# Altium schematic sheet Control.SchDoc: Primary Side Hardware - Control
size A4; Author: Primary Team; Revision: A; SheetNumber: 2; SheetTotal: 3
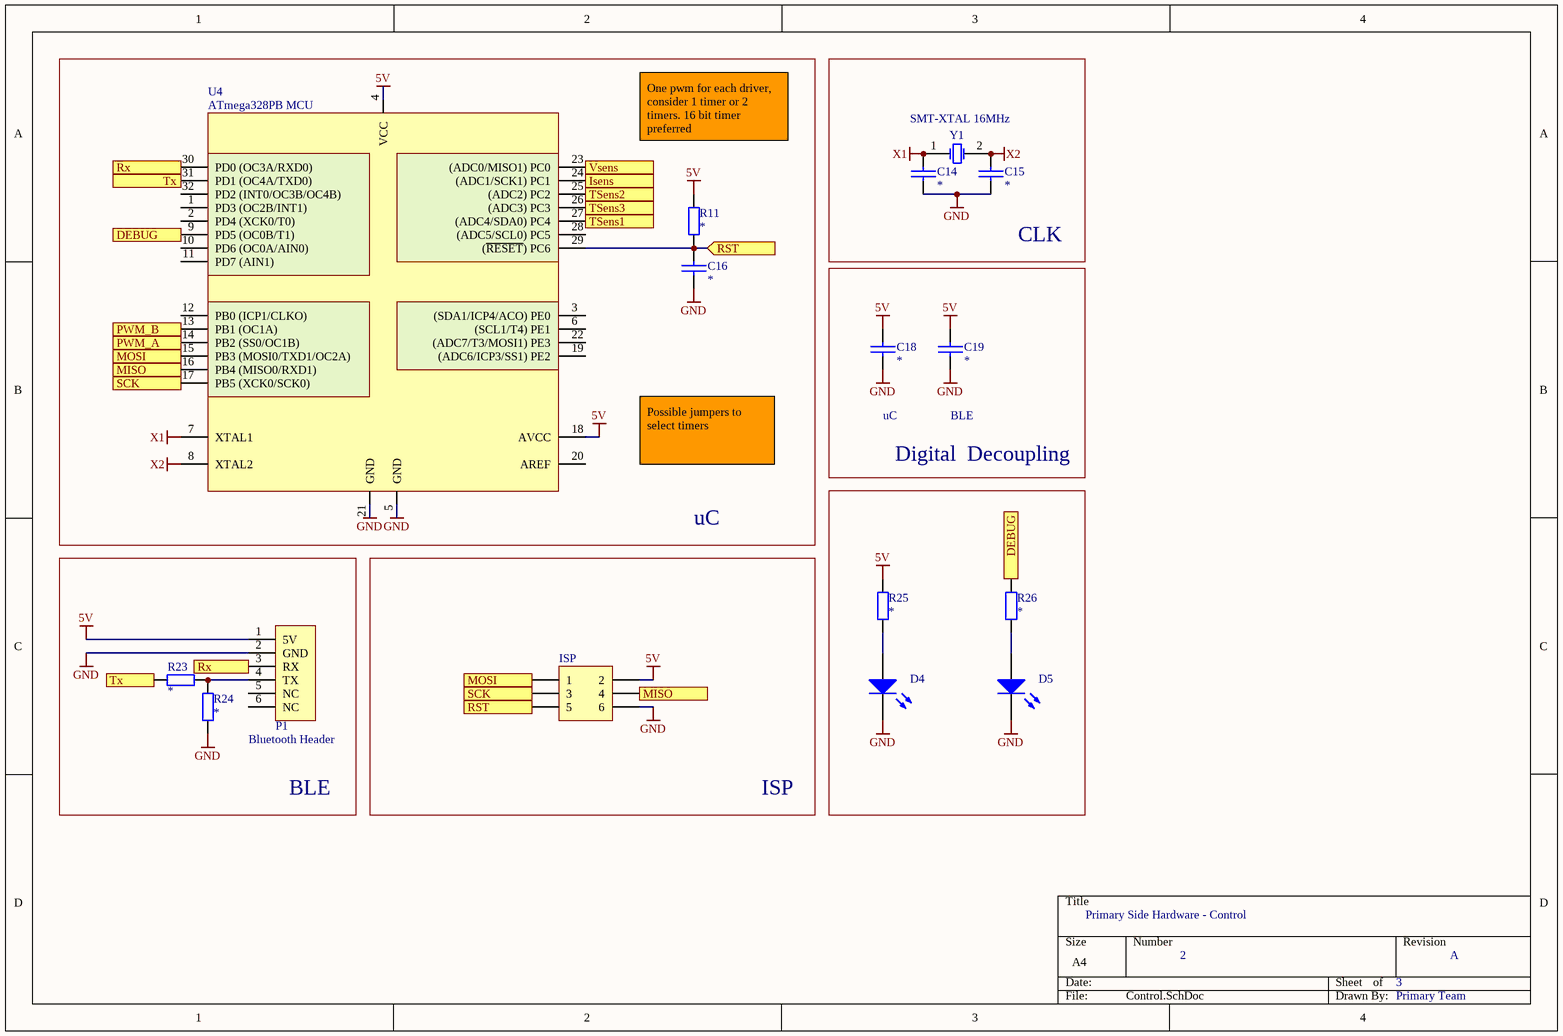
[diagram p0: Control.SchDoc]

## Parts
C14  *  [C0805]
C15  *  [C0805]
C16  *  [C0805]
C18  *  [C0805]
C19  *  [C0805]
D4  LTST-C170KGKT  [0805 LED]  (value not drawn)
D5  LTST-C170KGKT  [0805 LED]  (value not drawn)
ISP  P2  [HDR2X3]  (value not drawn)
P1  BLE Module Header  [HM10_HDR1X6]  (value not drawn)
R11  *  [R0805]
R23  *  [R0805]
R24  *  [R0805]
R25  *  [R0805]
R26  *  [R0805]
U4  ATmega328PB MCU  [32 - TQFP]
Y1  SMT-XTAL 16MHz  [HC49-US]

## Blocks framed on the sheet
uC: C16 R11 U4
CLK: C14 C15 Y1
BLE: P1 R23 R24
ISP: ISP

## Ports
DEBUG (in), DEBUG (out), Isens (in), MISO (in), MISO (out), MOSI (in), MOSI (out), PWM_A (out), PWM_B (out), RST (in), RST (out), Rx (in), Rx (out), SCK (in), SCK (out), TSens1 (in), TSens2 (in), TSens3 (in), Tx (in), Tx (out), Vsens (in)

## Nets
5V: C18.1 C19.1 ISP.2 P1.1(5V) R11.2 R25.2 U4.4(VCC) U4.18(AVCC)
GND: C14.2 C15.2 C16.2 C18.2 C19.2 D4.2(K) D5.2(K) ISP.6 P1.2(GND) R24.1 U4.5(GND) U4.21(GND)
X1: C14.1 U4.7(XTAL1) Y1.1(OSC1)
X2: C15.1 U4.8(XTAL2) Y1.2(OSC2)
DEBUG: R26.2 U4.9(PD5_(OC0B/T1)) ; port DEBUG
Isens: U4.24((ADC1/SCK1)_PC1) ; port Isens
MISO: ISP.4 U4.16(PB4_(MISO0/RXD1)) ; port MISO
MOSI: ISP.1 U4.15(PB3_(MOSI0/TXD1/OC2A)) ; port MOSI
PWM_A: U4.14(PB2_(SS0/OC1B)) ; port PWM_A
PWM_B: U4.13(PB1_(OC1A)) ; port PWM_B
RST: C16.1 ISP.5 R11.1 U4.29((~{RESET})_PC6) ; port RST
Rx: P1.3(RX) U4.30(PD0_(OC3A/RXD0)) ; port Rx
SCK: ISP.3 U4.17(PB5_(XCK0/SCK0)) ; port SCK
TSens1: U4.27((ADC4/SDA0)_PC4) ; port TSens1
TSens2: U4.25((ADC2)_PC2) ; port TSens2
TSens3: U4.26((ADC3)_PC3) ; port TSens3
Tx: R23.1 U4.31(PD1_(OC4A/TXD0)) ; port Tx
Vsens: U4.23((ADC0/MISO1)_PC0) ; port Vsens
NetD4_1: D4.1(A) R25.1
NetD5_1: D5.1(A) R26.1
NetP1_4: P1.4(TX) R23.2 R24.2

Not connected (* = marked no-connect by the designer): P1 5(NC) 6(NC); U4 1(PD3_(OC2B/INT1)) 2(PD4_(XCK0/T0)) 3((SDA1/ICP4/ACO)_PE0) 6((SCL1/T4)_PE1) 10(PD6_(OC0A/AIN0)) 11(PD7_(AIN1)) 12(PB0_(ICP1/CLKO)) 19((ADC6/ICP3/SS1)_PE2) 20(AREF) 22((ADC7/T3/MOSI1)_PE3) 28((ADC5/SCL0)_PC5) 32(PD2_(INT0/OC3B/OC4B))

## Notes on the sheet
- One pwm for each driver, consider 1 timer or 2 timers. 16 bit timer preferred
- uC
- BLE
- Possible jumpers to select timers
- Digital  Decoupling
- Bluetooth Header
- Primary Team

## Library data of the parts
C14-C16 C18 C19 = CerCap_SMT: SMT ceramic capacitor selectable size; Value: *
D4 D5 = LED_SMT_0805: SMT LED 0805 size; Manufacturer: Lite-On Inc.; Color: Green; Lens Color: Colorless; Lens Transparency: Clear; Millicandela Rating: 35mcd; Lens Style/Size: Rectangle with Flat Top, 1.40mm x 1.25mm; Voltage - Forward (Vf) (Typ): 2V; Current - Test: 20mA; Viewing Angle: 130°; Wavelength - Dominant: 571nm; Wavelength - Peak: 574nm; Supplier 1: Digi-Key; Manufacturer Part Number: LTST-C170KGKT; RoHS: RoHS Compliant; Category: Optoelectronics; Stock 1: 503069; Pricing 1: 1=0.62, 10=0.459, 25=0.338, 100=0.2415, 250=0.16416, 500=0.14486, 1000=0.11347 (NZD); Packaging: Cut Tape (CT); Part Status: Active; Mounting Type: Surface Mount; Features: -; Package / Case: 0805 (2012 Metric); Size / Dimension: 2.00mm L x 1.25mm W; Height (Max): 1.10mm; ComponentLink1URL: http://optoelectronics.liteon.com/upload/download/DS22-2000-073/LTST-C170KGKT.pdf; ComponentLink1Description: http://optoelectronics.liteon.com/upload/download/DS22-2000-073/LTST-C170KGKT.pdf; Supplier Part Number 1: 160-1414-1-ND
ISP = Header 3X2: Header, 3-Pin, Dual row; LatestRevisionDate: 17-Jul-2002; LatestRevisionNote: Re-released for DXP Platform.; Publisher: Altium Limited
P1 = BLEModule_TH: 2.54mm pitch 6-pin header for BLE module; LatestRevisionDate: 17-Jul-2002; LatestRevisionNote: Re-released for DXP Platform.; Publisher: Altium Limited
R11 R23-R26 = Res_SMT: 0805 or 1206 resistor; Published: 8-Jun-2000; LatestRevisionDate: 17-Jul-2002; LatestRevisionNote: Re-released for DXP Platform.; PackageReference: AXIAL-0.4; Publisher: Altium Limited; Value: *; ComponentLink1Description: https://nz.mouser.com/datasheet/2/315/AOA0000C304-1149620.pdf
U4 = ATmega328PB_SMT_TQFP32: IC MCU 8BIT 32KB FLASH 32TQFP; Manufacturer: Atmel; Manufacturer Part Number: ATMEGA328PB-AN; Core Processor: AVR; Core Size: 8-Bit; Speed: 20MHz; Connectivity: I²C, SPI, UART/USART; Peripherals: Brown-out Detect/Reset, POR, PWM, WDT; Number of I/O: 27; Program Memory Size: 32KB (16K x 16); EEPROM Size: 1K x 8; RAM Size: 2K x 8; Voltage - Supply (Vcc/Vdd): 1.8 V ~ 5.5 V; Data Converters: A/D 8x10b; Oscillator Type: Internal; Supplier 1: Digi-Key; RoHS: RoHS Compliant; Category: Integrated Circuits (ICs); Stock 1: 366; Pricing 1: 1=2.74, 10=2.448, 25=2.2032, 100=2.0074, 250=1.81152, 500=1.62548, 1000=1.37088 (USD); Packaging: Tray; Part Status: Active; Program Memory Type: FLASH; Operating Temperature: -40°C ~ 105°C (TA); Package / Case: 32-TQFP; Supplier Device Package: 32-TQFP (7x7); ComponentLink1URL: http://www.atmel.com/images/atmel-42397-8-bit-avr-microcontroller-atmega328pb_datasheet.pdf; ComponentLink1Description: http://www.atmel.com/images/atmel-42397-8-bit-avr-microcontroller-atmega328pb_datasheet.pdf
Y1 = TXC9C-16_XTAL_SMT: 9C-16.000MAAJ-T crystal 16.0000MHZ 18PF SMD; Manufacturer: TXC CORPORATION; Frequency Stability: ±30ppm; Operating Mode: Fundamental; Supplier 1: Digi-Key; Manufacturer Part Number: 9C-16.000MAAJ-T; RoHS: RoHS Compliant; Category: Crystals, Oscillators, Resonators; Stock 1: 11514; Pricing 1: 1=0.75, 10=0.628, 50=0.5656, 100=0.5026, 500=0.47744 (NZD); Packaging: Cut Tape (CT); Part Status: Active; Type: MHz Crystal; Frequency Tolerance: ±30ppm; Load Capacitance: 18pF; Operating Temperature: -20°C ~ 70°C; Ratings: -; Mounting Type: Surface Mount; Package / Case: HC-49/US; Size / Dimension: 0.449" L x 0.189" W (11.40mm x 4.80mm); Height - Seated (Max): 0.161" (4.10mm); ComponentLink1URL: http://www.txccorp.com/download/products/quartz_crystals/2015TXC_9C_32.pdf; ComponentLink1Description: http://www.txccorp.com/download/products/quartz_crystals/2015TXC_9C_32.pdf; Supplier Part Number 1: 887-1059-1-ND